# EAGLE design node_v1.1B (EAGLE 9.2.0)
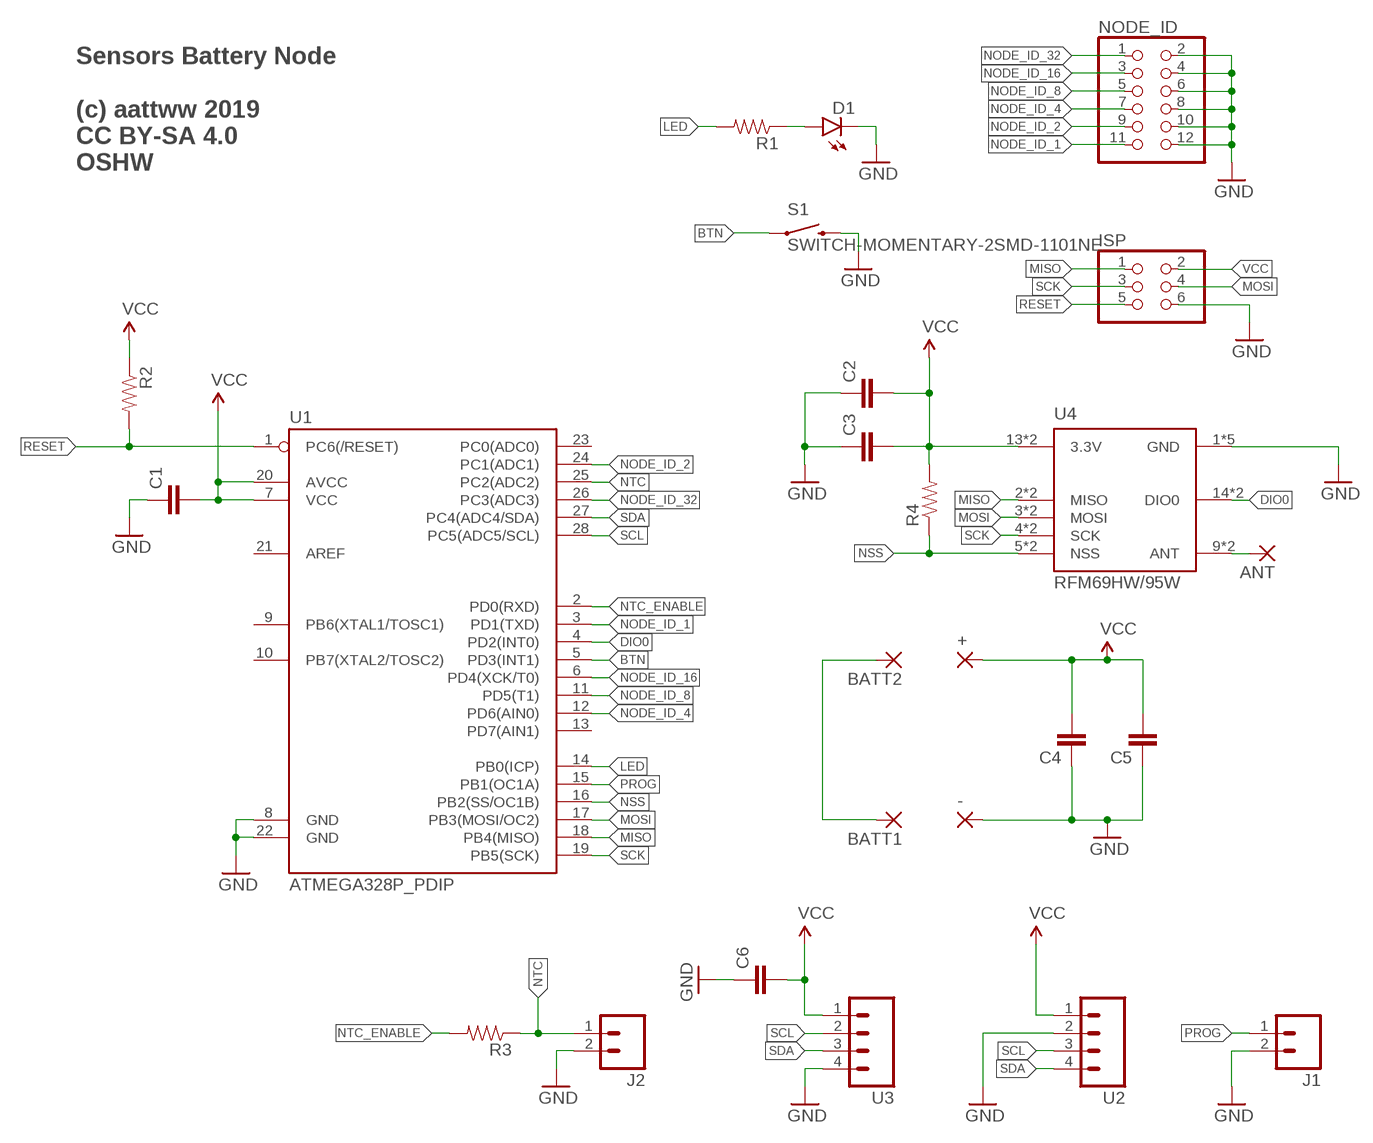
[diagram p0: schematic, sheet 1]

## Parts
+  2,15/1,0  [2,15/1,0]
-  2,15/1,0  [2,15/1,0]
ANT  2,15/1,0  [2,15/1,0]
BATT1  2,15/1,0  [2,15/1,0]
BATT2  2,15/1,0  [2,15/1,0]
C1  CAP1206  [1206]
C2  CAP1206  [1206]
C3  CAP1206  [1206]
C4  CAP1206  [1206]
C5  CAP1206  [1206]
C6  CAP1206  [1206]
D1  LED1206  [LED-1206]
ISP  PINHD-2X3  [2X03]
J1  M02PTH  [1X02]
J2  M02PTH  [1X02]
NODE_ID  PINHD-2X6  [2X06]
R1  RESISTOR1206  [1206]
R2  RESISTOR1206  [1206]
R3  RESISTOR1206  [1206]
R4  RESISTOR1206  [1206]
S1  SWITCH-MOMENTARY-2SMD-1101NE  [TACTILE-SWITCH-1101NE]
U1  ATMEGA328P_PDIP  [DIL28-3]
U2  M041X04_NO_SILK  [1X04_NO_SILK]
U3  M041X04_NO_SILK  [1X04_NO_SILK]
U4  RFM69HW/95W  [RFM69HW/95W]

## Nets
BTN: S1.1 U1.5(PD3(INT1))
DIO0: U1.4(PD2(INT0)) U4.14(DIO0) U4.22(DIO0)
GND: -.1(P) C1.1 C2.1 C3.1 C4.1 C5.1 C6.1 D1.C ISP.6 J1.2 J2.2 NODE_ID.2 NODE_ID.4 NODE_ID.6 NODE_ID.8 NODE_ID.10 NODE_ID.12 S1.2 U1.8(GND) U1.22(GND) U2.2 U3.4 U4.1(GND) U4.8(GND) U4.10(GND) U4.29(GND) U4.31(GND)
LED: R1.2 U1.14(PB0(ICP))
MISO: ISP.1 U1.18(PB4(MISO)) U4.2(MISO) U4.33(MISO)
MOSI: ISP.4 U1.17(PB3(MOSI/OC2)) U4.3(MOSI) U4.34(MOSI)
N$1: ANT.1(P) U4.9(ANT) U4.30(ANT)
N$2: BATT1.1(P) BATT2.1(P)
N$7: D1.A R1.1
NODE_ID_1: NODE_ID.11 U1.3(PD1(TXD))
NODE_ID_2: NODE_ID.9 U1.24(PC1(ADC1))
NODE_ID_4: NODE_ID.7 U1.12(PD6(AIN0))
NODE_ID_8: NODE_ID.5 U1.11(PD5(T1))
NODE_ID_16: NODE_ID.3 U1.6(PD4(XCK/T0))
NODE_ID_32: NODE_ID.1 U1.26(PC3(ADC3))
NSS: R4.1 U1.16(PB2(SS/OC1B)) U4.5(NSS) U4.35(NSS)
NTC: J2.1 R3.1 U1.25(PC2(ADC2))
NTC_ENABLE: R3.2 U1.2(PD0(RXD))
PROG: J1.1 U1.15(PB1(OC1A))
RESET: ISP.5 R2.2 U1.1(PC6(/RESET))
SCK: ISP.3 U1.19(PB5(SCK)) U4.4(SCK) U4.32(SCK)
SCL: U1.28(PC5(ADC5/SCL)) U2.3 U3.2
SDA: U1.27(PC4(ADC4/SDA)) U2.4 U3.3
VCC: +.1(P) C1.2 C2.2 C3.2 C4.2 C5.2 C6.2 ISP.2 R2.1 R4.2 U1.7(VCC) U1.20(AVCC) U2.1 U3.1 U4.13(3.3V) U4.28(3.3V)
Unconnected: U1.9(PB6(XTAL1/TOSC1)) U1.10(PB7(XTAL2/TOSC2)) U1.13(PD7(AIN1)) U1.21(AREF) U1.23(PC0(ADC0))

## Notes on the sheet
- Sensors Battery Node
  
  (c) aattww 2019
  CC BY-SA 4.0
  OSHW

## Library data of the parts
+ - ANT BATT1 BATT2 = wirepad:2,15/1,0: THROUGH-HOLE PAD
C1-C6 = SparkFun-Passives:CAP: Capacitor Standard 0603 ceramic capacitor, and 0.1" leaded capacitor.
D1 = SparkFun-LED:LED: LEDs Standard schematic elements and footprints for 5mm, 3mm, 1206, and 0603 sized LEDs. 5mm - Spark Fun Electronics SKU : COM-00529 (and others)
ISP = pinhead:PINHD-2X3: PIN HEADER
J1 J2 = SparkFun-Connectors:M02: Standard 2-pin 0.1" header. Use with - straight break away headers ( PRT-00116) - right angle break away headers (PRT-00553) - swiss pins (PRT-00743) - machine pins (PRT-00117) - female headers (PRT-00115) Molex polarized connector foot print use with: PRT-08233 with associated crimp pins and housings. 2.54_SCREWTERM for use with PRT-10571. 3.5mm Screw Terminal footprints for PRT-08084 5mm Screw Terminal footprints for use with PRT-08432
NODE_ID = pinhead:PINHD-2X6: PIN HEADER
R1-R4 = SparkFun-Passives:RESISTOR: Resistor Basic schematic elements and footprints for 0603, 1206, and PTH resistors.
S1 = SparkFun-Electromechanical:SWITCH-MOMENTARY-2: Various NO switches- pushbuttons, reed, etc; PROD_ID: SWCH-00815
U1 = SparkFun-DigitalIC:ATMEGA328P_PDIP: uC used in the Arduino 32kb flash, 1k EEPROM, 2k SRAM This is the through-hole version of this chip.
U2 U3 = SparkFun-Connectors:M04: Header 4 Standard 4-pin 0.1" header. Use with straight break away headers (SKU : PRT-00116), right angle break away headers (PRT-00553), swiss pins (PRT-00743), machine pins (PRT-00117), and female headers (PRT-00115). Molex polarized connector foot print use with SKU : PRT-08231 with associated crimp pins and housings. 1MM SMD Version SKU: PRT-10208; PROD_ID: CONN-09696
U4 = custom-rfm:RFM69HW/95W

## Board
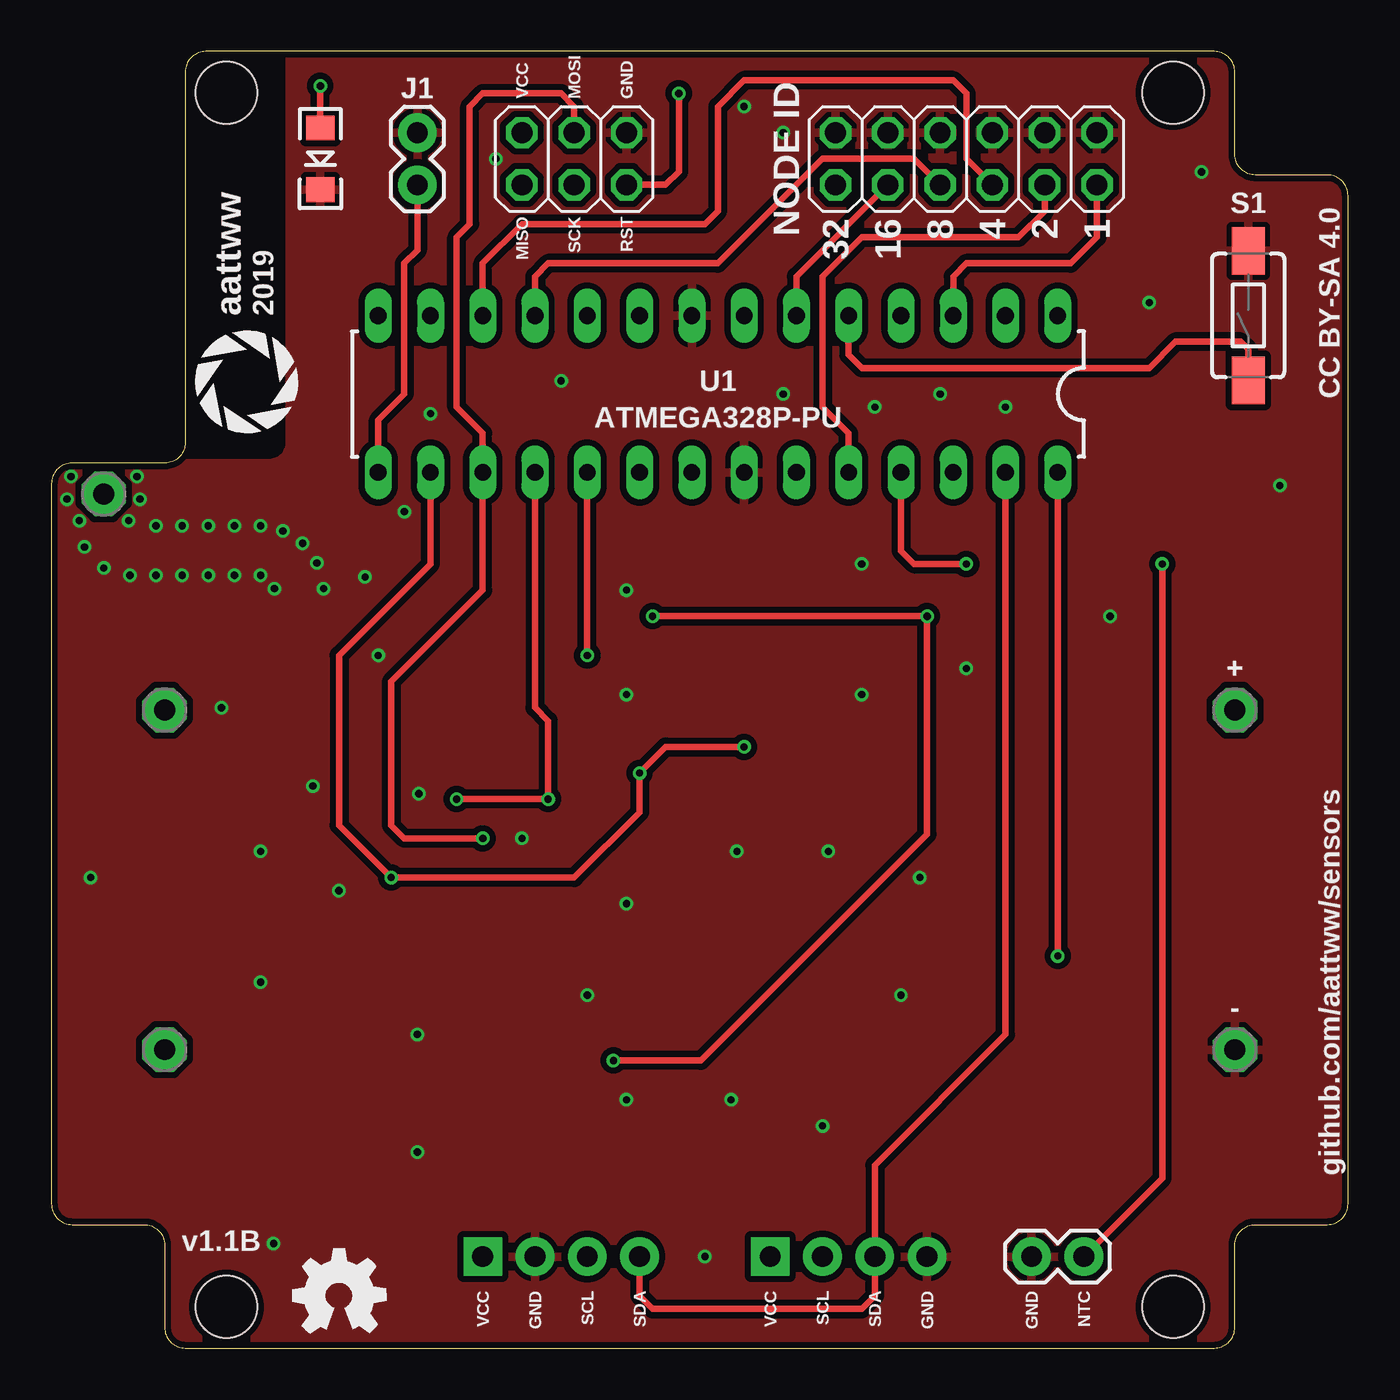
[diagram p1: board, top side]
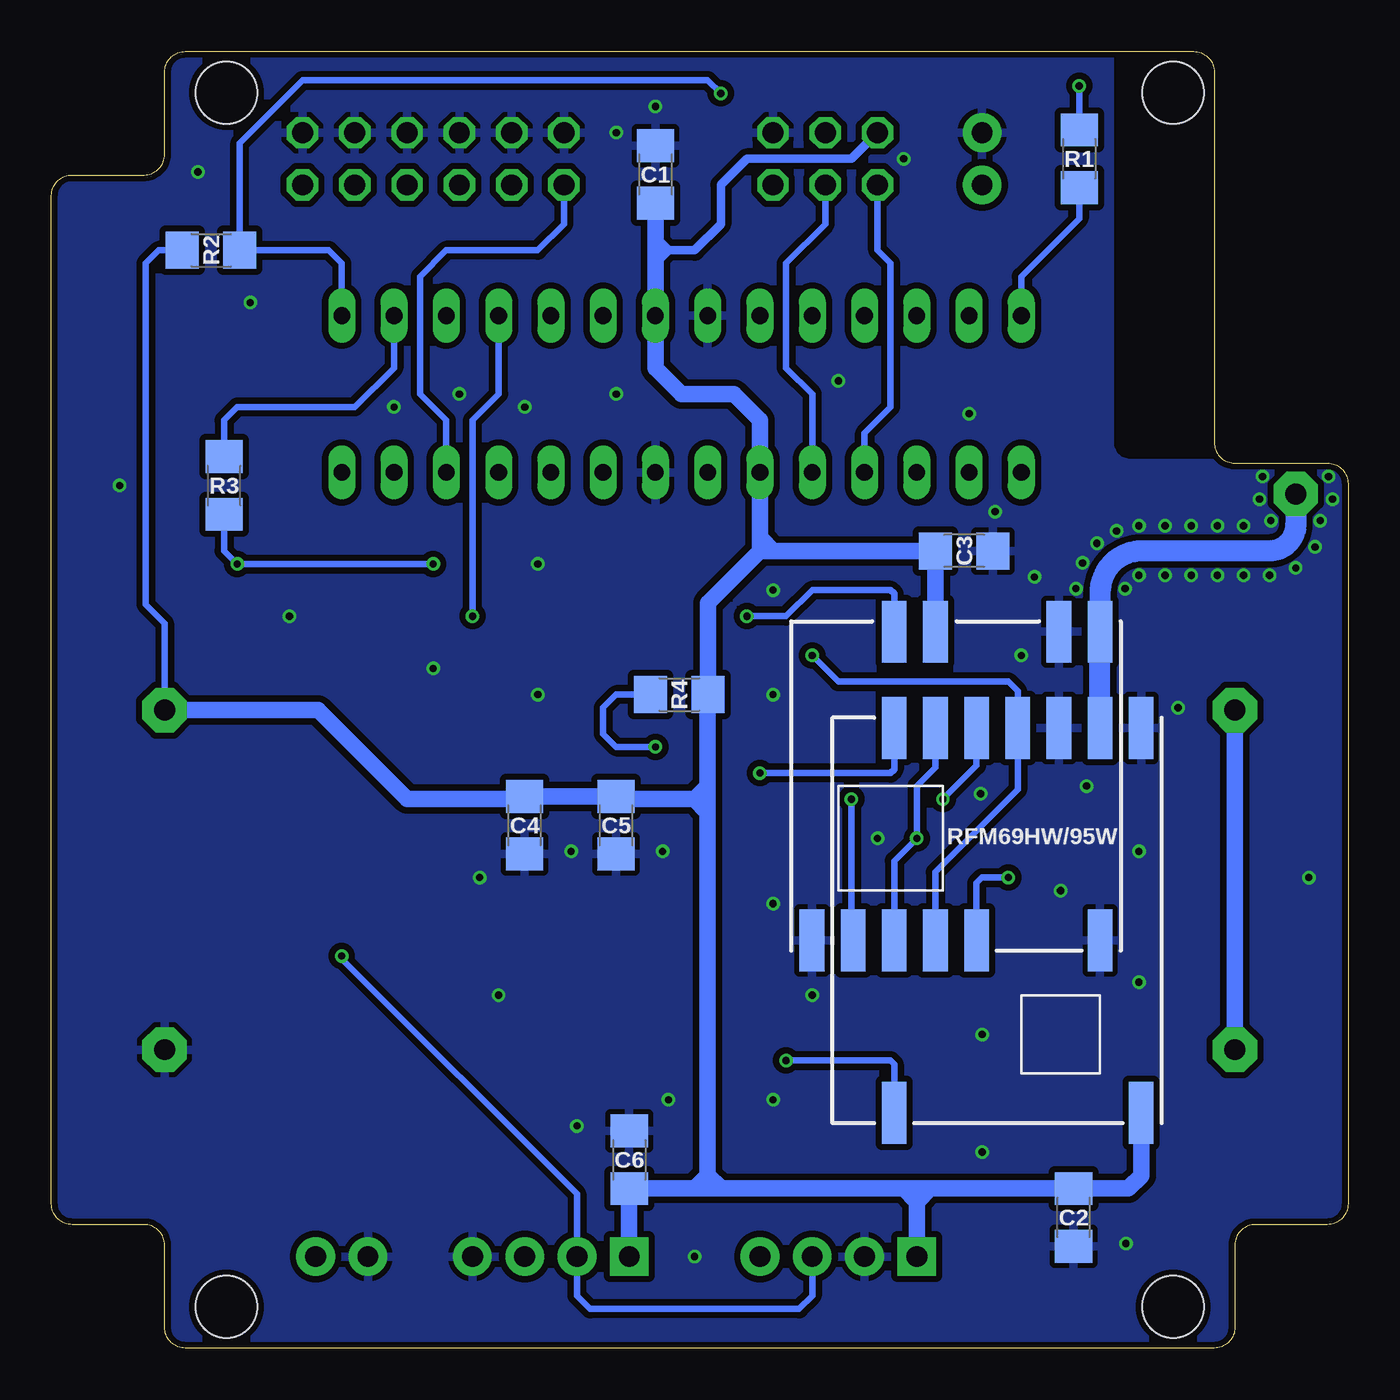
[diagram p2: board, bottom side, seen from below]

Size 63 x 63 mm. Coordinates in mm from the lower left corner, seen from the top.
Outline: 56.5,63 7.5,63 arc90 6.5,62 6.5,44 arc-90 5.5,43 1,43 arc90 0,42 0,7 arc90 1,6 4.5,6 arc-90 5.5,5 5.5,1 arc90 6.5,0 56.5,0 arc90 57.5,1 57.5,5 arc-90 58.5,6 62,6 arc90 63,7 63,56 arc90 62,57 58.5,57 arc-90 57.5,58 57.5,62 arc90 56.5,63
Copper layers (1*16): Top 0.035mm / dielectric 1.5mm / Bottom 0.035mm
Design rules "SeeedStudio_2layer_DRU_no_angle_20140221": minimum track width 6mil, minimum drill 12mil, track to track 6mil, track to pad 6mil, pad to pad 6mil, via to via 6mil, smd to smd 0mil, copper to edge 10mil, drill to drill 10mil, minimum pad ring 10mil, minimum via ring 6mil, stop-mask expansion 2mil, vias tented up to drill 100mil, thermal gap 10mil
Holes 3 mm at 54.5,61 54.5,2 8.5,2 8.5,61

### Footprints (pad centres in the part's own frame; a part is rotated, then mirrored left to right if it is on the bottom)
2,15/1,0 = drill 1.016 pad 2.159 octagon: 1 0,0
1206 = smd 1.6 x 1.8: 1 -1.4,0; 2 1.4,0
LED-1206 = smd 1.2 x 1.4: A -1.5,0; C 1.5,0
2X03 = drill 1.016 octagon: 1 -2.54,-1.27; 2 -2.54,1.27; 3 0,-1.27; 4 0,1.27; 5 2.54,-1.27; 6 2.54,1.27
1X02 = drill 1.016 pad 1.88: 1 0,0; 2 2.54,0
2X06 = drill 1.016 octagon: 1 -6.35,-1.27; 2 -6.35,1.27; 3 -3.81,-1.27; 4 -3.81,1.27; 5 -1.27,-1.27; 6 -1.27,1.27; 7 1.27,-1.27; 8 1.27,1.27; 9 3.81,-1.27; 10 3.81,1.27; 11 6.35,-1.27; 12 6.35,1.27
TACTILE-SWITCH-1101NE = smd 2.3 x 1.6: 1 -3.15,0; 2 3.15,0
DIL28-3 = drill 0.813 long: 1 -16.51,-3.81; 2 -13.97,-3.81; 3 -11.43,-3.81; 4 -8.89,-3.81; 5 -6.35,-3.81; 6 -3.81,-3.81; 7 -1.27,-3.81; 8 1.27,-3.81; 9 3.81,-3.81; 10 6.35,-3.81; 11 8.89,-3.81; 12 11.43,-3.81; 13 13.97,-3.81; 14 16.51,-3.81; 15 16.51,3.81; 16 13.97,3.81; 17 11.43,3.81; 18 8.89,3.81; 19 6.35,3.81; 20 3.81,3.81; 21 1.27,3.81; 22 -1.27,3.81; 23 -3.81,3.81; 24 -6.35,3.81; 25 -8.89,3.81; 26 -11.43,3.81; 27 -13.97,3.81; 28 -16.51,3.81
1X04_NO_SILK = drill 1.016 pad 1.88 square: 1 0,0 | drill 1.016 pad 1.88: 2 2.54,0; 3 5.08,0; 4 7.62,0
RFM69HW/95W = smd 3 x 1.2: 1 -3.055,8.27; 2 -3.055,6.27; 3 -3.055,4.27; 4 -3.055,2.27; 5 -3.055,0.27; 8 -3.055,-5.73; 9 11.945,-5.73; 10 11.945,-3.73; 13 11.945,2.27; 14 11.945,4.27; 22 -11.43,4.27; 28 -11.43,-7.73; 29 7.27,-7.73; 30 7.27,-5.73; 31 7.27,-3.73; 32 7.27,-1.73; 33 7.27,0.27; 34 7.27,2.27; 35 7.27,4.27

### Placement (x,y rotation side)
+  57.5,31 0 top
-  57.5,14.5 0 top
ANT  2.54,41.5 0 top
BATT1  5.5,31 0 top
BATT2  5.5,14.5 0 top
C1  33.66,57.02 270 bottom
C2  13.34,6.35 90 bottom
C3  18.65,38.73 180 bottom
C4  40.01,25.4 90 bottom
C5  35.56,25.4 90 bottom
C6  34.92,9.15 270 bottom
D1  13.06,57.78 270 top
ISP  25.4,57.78 0 top
J1  17.78,56.52 90 top
J2  50.16,4.45 180 top
NODE_ID  44.45,57.78 0 top
R1  13.06,57.78 270 bottom
R2  55.24,53.34 0 bottom
R3  54.61,41.91 90 bottom
R4  32.5,31.75 0 bottom
S1  58.15,50.16 90 top
U1  32.38,46.35 180 top
U2  20.95,4.45 0 top
U3  34.92,4.45 0 top
U4  17.78,22.86 90 bottom
U$1  [OSHW_5MM]  13.97,2.54 0 top
U$2  [LOGO_5MM]  9.53,46.99 0 top

### Tracks (layer width: path | path; a pad name or v marks a point on that pad's centre or on a via)
BTN
  Top 0.305: U1.5 38.73,48.26 39.37,47.62 53.34,47.62 54.61,48.9 57.78,48.9 58.15,48.53 S1.1
DIO0  (via drill 0.35)
  Top 0.305: v29.21,35.56 v42.55,35.56 42.55,24.96 31.55,13.97 v27.3,13.97
  Bottom 0.305: U1.4 41.27,46.35 42.55,45.09 v42.55,35.56 | U4.22 22.05,13.79 22.23,13.97 v27.3,13.97 | U4.14 22.05,36.66 22.23,36.83 26.04,36.83 27.3,35.56 v29.21,35.56
GND  (via drill 0.35)
  other vias: 10.79,5.08 27.94,12.06 46.35,45.72 51.44,35.56 44.45,33.02 17.78,9.53 41.27,17.14 35.56,46.35 55.88,57.15 39.37,38.1 31.75,4.45 59.69,41.91 27.94,21.59 1.91,22.86 24.77,46.99 15.88,33.66 17.85,26.93 27.94,31.75 10.16,24.13 17.78,15.24 40.01,45.72 53.34,50.8 27.94,36.83 18.41,45.4 13.97,22.23 22.86,24.77 39.37,31.75 37.75,24.13 12.9,38.15 13.22,36.9 43.18,46.35 10.16,17.78 21.59,57.78 12.2,39.1 11.25,39.7 5.08,39.95 4.15,42.35 3.75,40.2 4.3,41.25 0.75,41.25 0.95,42.35 1.35,40.2 5.08,37.55 6.35,39.95 7.62,39.95 8.89,39.95 10.16,39.95 6.35,37.55 7.62,37.55 8.89,37.55 10.16,37.55 3.81,37.55 2.54,37.9 1.6,38.92 10.83,36.9 35.56,59.05 33.66,60.33 15.24,37.47 17.14,40.64 12.7,27.3 8.26,31.11 26.04,17.14 33.3,24.13 42.2,22.86 33.02,12.06 37.47,10.79
  pour Bottom (isolate 0.305): 56.5,63 11.58,63 11.58,44 arc-90 10.58,43 1,43 arc90 0,42 0,7 arc90 1,6 4.5,6 arc-90 5.5,5 5.5,1 arc90 6.5,0 56.5,0 arc90 57.5,1 57.5,5 arc-90 58.5,6 62,6 arc90 63,7 63,56 arc90 62,57 58.5,57 arc-90 57.5,58 57.5,62 arc90
  pour Top (isolate 0.305): 56.5,63 11.58,63 11.58,44 arc-90 10.58,43 1,43 arc90 0,42 0,7 arc90 1,6 4.5,6 arc-90 5.5,5 5.5,1 arc90 6.5,0 56.5,0 arc90 57.5,1 57.5,5 arc-90 58.5,6 62,6 arc90 63,7 63,56 arc90 62,57 58.5,57 arc-90 57.5,58 57.5,62 arc90
LED
  Bottom 0.305: R1.2 13.06,54.88 15.88,52.07 U1.14
MISO  (via drill 0.35)
  Top 0.305: v19.68,26.67 v24.13,26.67 24.13,30.48 23.5,31.11 U1.18
  Bottom 0.305: v24.13,26.67 24.13,19.89 U4.2 | U4.33 18.05,28.3 v19.68,26.67 | ISP.1 22.86,53.34 22.23,52.7 22.23,45.72 23.5,44.45 U1.18
MOSI  (via drill 0.35)
  Top 0.305: v20.95,24.77 17.14,24.77 16.51,25.4 16.51,32.38 20.95,36.83 U1.17 20.95,44.45 19.68,45.72 19.68,53.98 20.32,54.61 20.32,60.33 20.95,60.96 24.77,60.96 25.4,60.33 ISP.4
  Bottom 0.305: U4.3 22.05,23.67 v20.95,24.77 20.95,27.3 20.05,28.21 U4.34
N$1
  Bottom 1.016: U4.30 U4.9 12.05,36.71 arc90 10.03,38.73 3.81,38.73 arc-90 2.54,40.01 ANT.1
N$2
  Bottom 0.813: BATT1.1 BATT2.1
N$7  (via drill 0.35)
  Top 0.305: D1.A v13.06,61.33
  Bottom 0.305: R1.1 v13.06,61.33
NODE_ID_1
  Top 0.305: NODE_ID.11 50.8,53.98 49.53,52.7 44.45,52.7 43.81,52.07 U1.3
NODE_ID_2
  Top 0.305: U1.24 38.73,44.45 37.47,45.72 37.47,52.07 39.37,53.98 46.99,53.98 48.26,55.24 NODE_ID.9
NODE_ID_4
  Top 0.305: NODE_ID.7 44.45,57.78 44.45,60.96 43.81,61.59 33.66,61.59 32.38,60.33 32.38,55.24 31.75,54.61 22.86,54.61 20.95,52.7 U1.12
NODE_ID_8
  Top 0.305: NODE_ID.5 41.91,57.78 37.47,57.78 32.38,52.7 24.13,52.7 23.5,52.07 U1.11
NODE_ID_16
  Top 0.305: NODE_ID.3 36.2,52.07 U1.6
NODE_ID_32
  Bottom 0.305: NODE_ID.1 38.1,54.61 39.37,53.34 43.81,53.34 45.09,52.07 45.09,46.35 43.81,45.09 U1.26
NSS  (via drill 0.35)
  Top 0.305: U1.16 18.41,38.1 13.97,33.66 13.97,25.4 v16.51,22.86 25.4,22.86 28.57,26.04 v28.57,27.94 29.84,29.21 v33.66,29.21
  Bottom 0.305: U4.5 18.05,22.59 17.78,22.86 v16.51,22.86 | U4.35 22.05,28.11 22.23,27.94 v28.57,27.94 | R4.1 35.56,31.75 36.2,31.11 36.2,29.84 35.56,29.21 v33.66,29.21
NTC  (via drill 0.35)
  Top 0.305: U1.25 41.27,38.73 41.91,38.1 v44.45,38.1 | J2.1 53.98,8.26 v53.98,38.1
  Bottom 0.305: R3.1 54.61,38.73 v53.98,38.1 v44.45,38.1
NTC_ENABLE
  Bottom 0.305: U1.2 46.35,47.62 48.26,45.72 53.98,45.72 54.61,45.09 R3.2
PROG
  Top 0.305: U1.15 15.88,45.09 17.14,46.35 17.14,52.7 17.78,53.34 J1.1
RESET  (via drill 0.35)
  Top 0.305: ISP.5 29.84,56.52 30.48,57.15 v30.48,60.96
  Bottom 0.305: U1.1 48.9,52.7 49.53,53.34 R2.2 53.84,58.55 50.8,61.59 31.11,61.59 v30.48,60.96
SCK  (via drill 0.35)
  Top 0.305: v26.04,33.66 U1.19
  Bottom 0.305: U4.4 20.05,23.13 16.05,27.13 U4.32 16.05,31.93 16.51,32.38 24.77,32.38 v26.04,33.66 | ISP.3 25.4,54.61 27.3,52.7 27.3,47.62 26.04,46.35 U1.19
SCL  (via drill 0.35)
  Top 0.305: U1.28 v48.9,19.05
  Bottom 0.305: v48.9,19.05 48.9,18.92 37.47,7.49 U3.2 37.47,2.54 36.83,1.91 26.67,1.91 26.04,2.54 U2.3
SDA
  Top 0.305: U1.27 46.35,15.24 40.01,8.89 U3.3 40.01,2.54 39.37,1.91 29.21,1.91 28.57,2.54 U2.4
VCC
  Bottom 0.305: +.1 57.5,35.21 58.42,36.13 58.42,52.7 57.78,53.34 R2.1
  Bottom 0.406: ISP.2 24.13,57.78 29.21,57.78 30.48,56.52 30.48,54.61 31.75,53.34 33.02,53.34 | 33.02,53.34 33.66,53.34 | 33.02,53.34 33.66,52.7 33.66,52.07 | 33.02,53.34 33.66,53.98 33.66,54.61
  Bottom 0.813: 31.11,26.04 31.11,26.67 | 31.11,26.67 31.11,27.3 | 31.11,26.67 31.75,26.67 | 31.11,26.04 31.75,26.67 | 31.75,26.67 31.11,27.3 | 31.75,26.67 35.43,26.67 C5.2 C4.2 40.13,26.67 45.72,26.67 50.05,31 +.1 | U4.13 C3.2 27.94,38.73 | U4.28 10.05,8.37 10.66,7.75 C2.2 20.32,7.75 | 28.57,39.37 U1.20 28.57,45.09 29.84,46.35 32.38,46.35 33.66,47.62 U1.7 33.66,52.07 33.66,53.34 33.66,54.61 C1.2 | 28.57,39.37 28.57,38.73 | 28.57,38.73 27.94,38.73 | 31.11,27.3 31.11,31.73 R4.2 31.1,36.21 28.57,38.73 | 27.94,38.73 28.57,39.37 | U3.1 C6.2 31.75,7.75 | 30.48,7.75 21.59,7.75 | 21.59,7.75 20.32,7.75 | 30.48,7.75 31.11,7.75 | 31.11,7.75 31.11,8.38 | 31.11,8.38 31.11,26.04 | 31.75,7.75 31.11,7.75 | 31.11,8.38 31.75,7.75 | 31.11,8.38 30.48,7.75 | U2.1 20.95,7.12 | 20.95,7.12 21.59,7.75 | 20.32,7.75 20.95,7.12

### Text on the board
tNames: VCC | MOSI | GND | NODE ID | MISO | SCK | RST | 32 | 16 | 8 | 4 | 2 | 1 | CC BY-SA 4.0 | 2019 | aattww | U1 | ATMEGA328P-PU | github.com/aattww/sensors | v1.1B | VCC | GND | SCL | SDA | VCC | SCL | SDA | GND | GND | NTC
Document: Enclosure: Supertronic PP42